# Altium schematic sheet Sheet_PLC.SchDoc
size A4; SheetNumber: 1; SheetTotal: 1
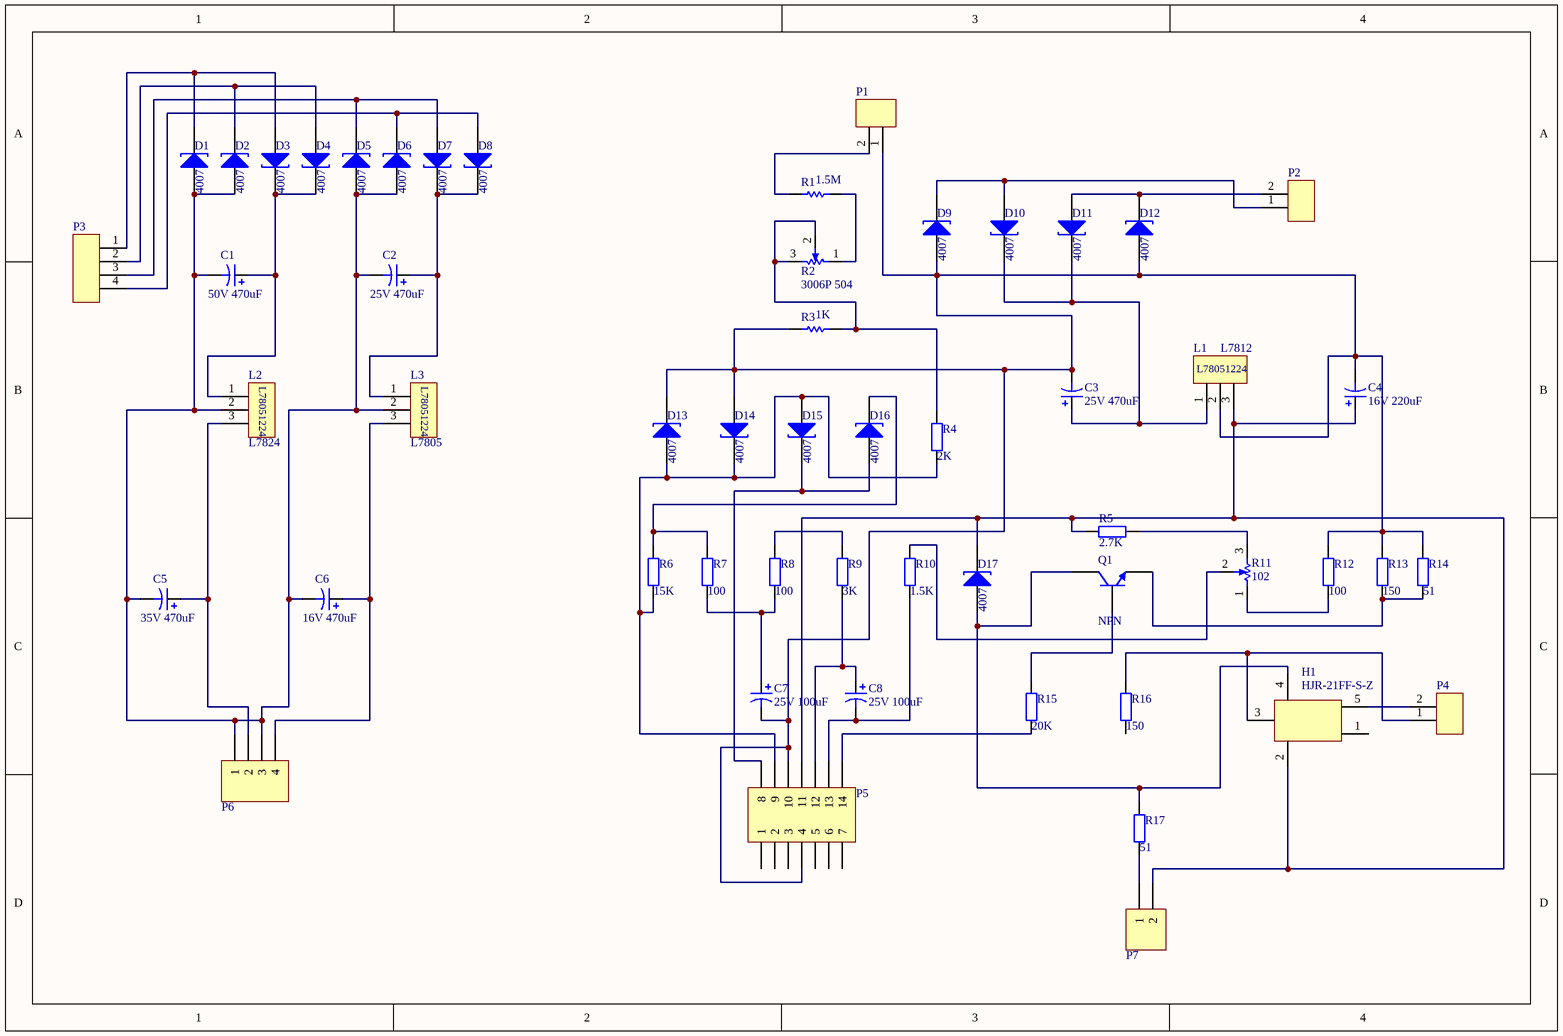
[diagram p0: Sheet_PLC.SchDoc]

## Parts
C1  value 50V 470uF  [RB7.6-15]  (hidden comment: Cap Pol1)
C2  value 25V 470uF  [RB7.6-15]  (hidden comment: Cap Pol1)
C3  value 25V 470uF  [RB7.6-15]  (hidden comment: Cap Pol1)
C4  value 16V 220uF  [RB7.6-15]  (hidden comment: Cap Pol1)
C5  value 35V 470uF  [RB7.6-15]  (hidden comment: Cap Pol1)
C6  value 16V 470uF  [RB7.6-15]  (hidden comment: Cap Pol1)
C7  value 25V 100uF  [RB7.6-15]  (hidden comment: Cap Pol1)
C8  value 25V 100uF  [RB7.6-15]  (hidden comment: Cap Pol1)
D1  4007  [DIODE-0.4]
D2  4007  [DIODE-0.4]
D3  4007  [DIODE-0.4]
D4  4007  [DIODE-0.4]
D5  4007  [DIODE-0.4]
D6  4007  [DIODE-0.4]
D7  4007  [DIODE-0.4]
D8  4007  [DIODE-0.4]
D9  4007  [DIODE-0.4]
D10  4007  [DIODE-0.4]
D11  4007  [DIODE-0.4]
D12  4007  [DIODE-0.4]
D13  4007  [DIODE-0.4]
D14  4007  [DIODE-0.4]
D15  4007  [DIODE-0.4]
D16  4007  [DIODE-0.4]
D17  4007  [DIODE-0.4]
H1  HJR-21FF-S-Z  [HJR-21FF-S-Z 12V]
L1  L7812  [L78051224]
L2  L7824  [L78051224]
L3  L7805  [L78051224]
P1  CH3.96 2P  [CH3.96 2P]  (value not drawn)
P2  CH3.96 2P  [CH3.96 2P]  (value not drawn)
P3  CH3.96 4P  [CH3.96 4P]  (value not drawn)
P4  CH3.96 2P  [CH3.96 2P]  (value not drawn)
P5  Header 7X2A  [Header 7X2A]  (value not drawn)
P6  Header 4  [HDRR1X4]  (value not drawn)
P7  Header 2  [HDRR1X2]  (value not drawn)
Q1  NPN  [S0914]
R1  value 1.5M  [R1.5M1W]  (hidden comment: Res1)
R2  3006P 504  [R504]
R3  value 1K  [R1K1W]  (hidden comment: Res1)
R4  value 2K  [AXIAL-0.4]  (hidden comment: Res2)
R5  value 2.7K  [AXIAL-0.4]  (hidden comment: Res2)
R6  value 15K  [AXIAL-0.4]  (hidden comment: Res2)
R7  value 100  [AXIAL-0.4]  (hidden comment: Res2)
R8  value 100  [AXIAL-0.4]  (hidden comment: Res2)
R9  value 3K  [AXIAL-0.4]  (hidden comment: Res2)
R10  value 1.5K  [AXIAL-0.4]  (hidden comment: Res2)
R11  102  [R102]
R12  value 100  [AXIAL-0.4]  (hidden comment: Res2)
R13  value 150  [AXIAL-0.4]  (hidden comment: Res2)
R14  value 51  [AXIAL-0.4]  (hidden comment: Res2)
R15  value 20K  [AXIAL-0.4]  (hidden comment: Res2)
R16  value 150  [AXIAL-0.4]  (hidden comment: Res2)
R17  value 51  [AXIAL-0.4]  (hidden comment: Res2)

## Nets
NetC1_1: C1.1 D3.2(K) D4.2(K) L2.1
NetC1_2: C1.2 C2.2 C5.2 C6.2 D1.1(A) D2.1(A) D5.1(A) D6.1(A) L2.2 L3.2 P6.1 P6.3
NetC2_1: C2.1 D7.2(K) D8.2(K) L3.1
NetC3_1: C3.1 D10.2(K) D11.2(K) L1.1
NetC3_2: C3.2 C4.2 C7.2 D9.1(A) D12.1(A) D13.2(K) D14.1(A) L1.2 P1.1 P5.4 P5.10 R3.1 R12.2 R13.2 R14.2
NetC4_1: C4.1 D17.2(K) H1.2 L1.3 P5.11 P7.2 R5.2
NetC5_1: C5.1 L2.3 P6.2
NetC6_1: C6.1 L3.3 P6.4
NetC7_1: C7.1 R7.1 R8.1
NetC8_1: C8.1 P5.12 R9.1
NetC8_2: C8.2 P5.13 R10.1
NetD1_2: D1.2(K) D3.1(A) P3.1
NetD2_2: D2.2(K) D4.1(A) P3.2
NetD5_2: D5.2(K) D7.1(A) P3.3
NetD6_2: D6.2(K) D8.1(A) P3.4
NetD9_2: D9.2(K) D10.1(A) P2.1
NetD11_1: D11.1(A) D12.2(K) P2.2
NetD13_1: D13.1(A) D14.2(K) D15.1(A) P5.9 R4.1 R6.1
NetD15_2: D15.2(K) D16.1(A) P5.8
NetD16_2: D16.2(K) R6.2 R7.2
NetD17_1: D17.1(A) H1.4 Q1.1(C) R17.2
NetH1_3: H1.3 P4.1 R16.2
NetH1_5: H1.5 P4.2
NetP1_2: P1.2 R1.1
NetP5_14: P5.14 R15.1
NetP7_1: P7.1 R17.1
NetQ1_2: Q1.2(B) R15.2
NetQ1_3: Q1.3(E) R13.1 R14.1
NetR1_2: R1.2 R2.1
NetR2_2: R2.2 R2.3 R3.2 R4.2
NetR5_1: R5.1 R11.3
NetR8_2: R8.2 R9.2
NetR10_2: R10.2 R11.2
NetR11_1: R11.1 R12.1

Not connected (* = marked no-connect by the designer): H1 1; P5 1 2 3 5 6 7; R16 1

## Library data of the parts
C1-C8 = Cap Pol1: Polarized Capacitor (Radial); Published: 8-Jun-2000; LatestRevisionDate: 17-Jul-2002; LatestRevisionNote: Re-released for DXP Platform.; PackageReference: RB7.6-15; Publisher: Altium Limited; PackageDescription: Polarized Capacitor (Radial); 2 Leads
D1-D17 = D Tunnel2: Tunnel Diode - Dependent Source Model; Published: 15-Apr-2002; LatestRevisionDate: 17-Jul-2002; LatestRevisionNote: Re-released for DXP Platform.; PackageReference: DIODE-0.4; Publisher: Altium Limited; PackageDescription: Diode, Thru-Hole; 2 Leads; 0.4 in Pin Spacing
L1-L3 = L78051224
P5 = Header 7X2A: Header, 7-Pin, Dual row; LatestRevisionDate: 17-Jul-2002; LatestRevisionNote: Re-released for DXP Platform.; Publisher: Altium Limited
P6 = Header 4: Header, 4-Pin; LatestRevisionDate: 17-Jul-2002; LatestRevisionNote: Re-released for DXP Platform.; Publisher: Altium Limited
P7 = Header 2: Header, 2-Pin; LatestRevisionDate: 17-Jul-2002; LatestRevisionNote: Re-released for DXP Platform.; Publisher: Altium Limited
Q1 = NPN: NPN Bipolar Transistor; Published: 8-Jun-2000; LatestRevisionDate: 17-Jul-2002; LatestRevisionNote: Re-released for DXP Platform.; PackageReference: TO-226-AA; Publisher: Altium Limited; PackageDescription: TO, Flat Index; 3 In-Line, Axial Leads; Body Dia. 4.8mm; Leads 0.55 x 0.51 mm (max); Code_JEDEC: TO-226-AA
R1 R3 = Res1: Resistor; Published: 8-Jun-2000; LatestRevisionDate: 17-Jul-2002; LatestRevisionNote: Re-released for DXP Platform.; PackageReference: AXIAL-0.3; Publisher: Altium Limited; PackageDescription: Axial Device, Thru-Hole; 2 Leads; 0.3 in Pin Spacing
R2 = RPot SM_1: Square Trimming Potentiometer; Published: 17-Dec-2003; DatasheetVersion: Oct-2003; PackageReference: POT4MM-2; Publisher: Altium Limited; PackageDescription: Square Trimming Potentiometer; ComponentLink1Description: Manufacturer Link; ComponentLink1URL: http://bourns.com/2/search.html
R4-R10 R12-R17 = Res2: Resistor; Published: 8-Jun-2000; LatestRevisionDate: 17-Jul-2002; LatestRevisionNote: Re-released for DXP Platform.; PackageReference: AXIAL-0.4; Publisher: Altium Limited; PackageDescription: Axial Device, Thru-Hole; 2 Leads; 0.4 in Pin Spacing
R11 = RPot SM: Square Trimming Potentiometer; Published: 17-Dec-2003; DatasheetVersion: Oct-2003; PackageReference: POT4MM-2; Publisher: Altium Limited; PackageDescription: Square Trimming Potentiometer; ComponentLink1Description: Manufacturer Link; ComponentLink1URL: http://bourns.com/2/search.html